# Altium project PCB_Project.PrjPcb
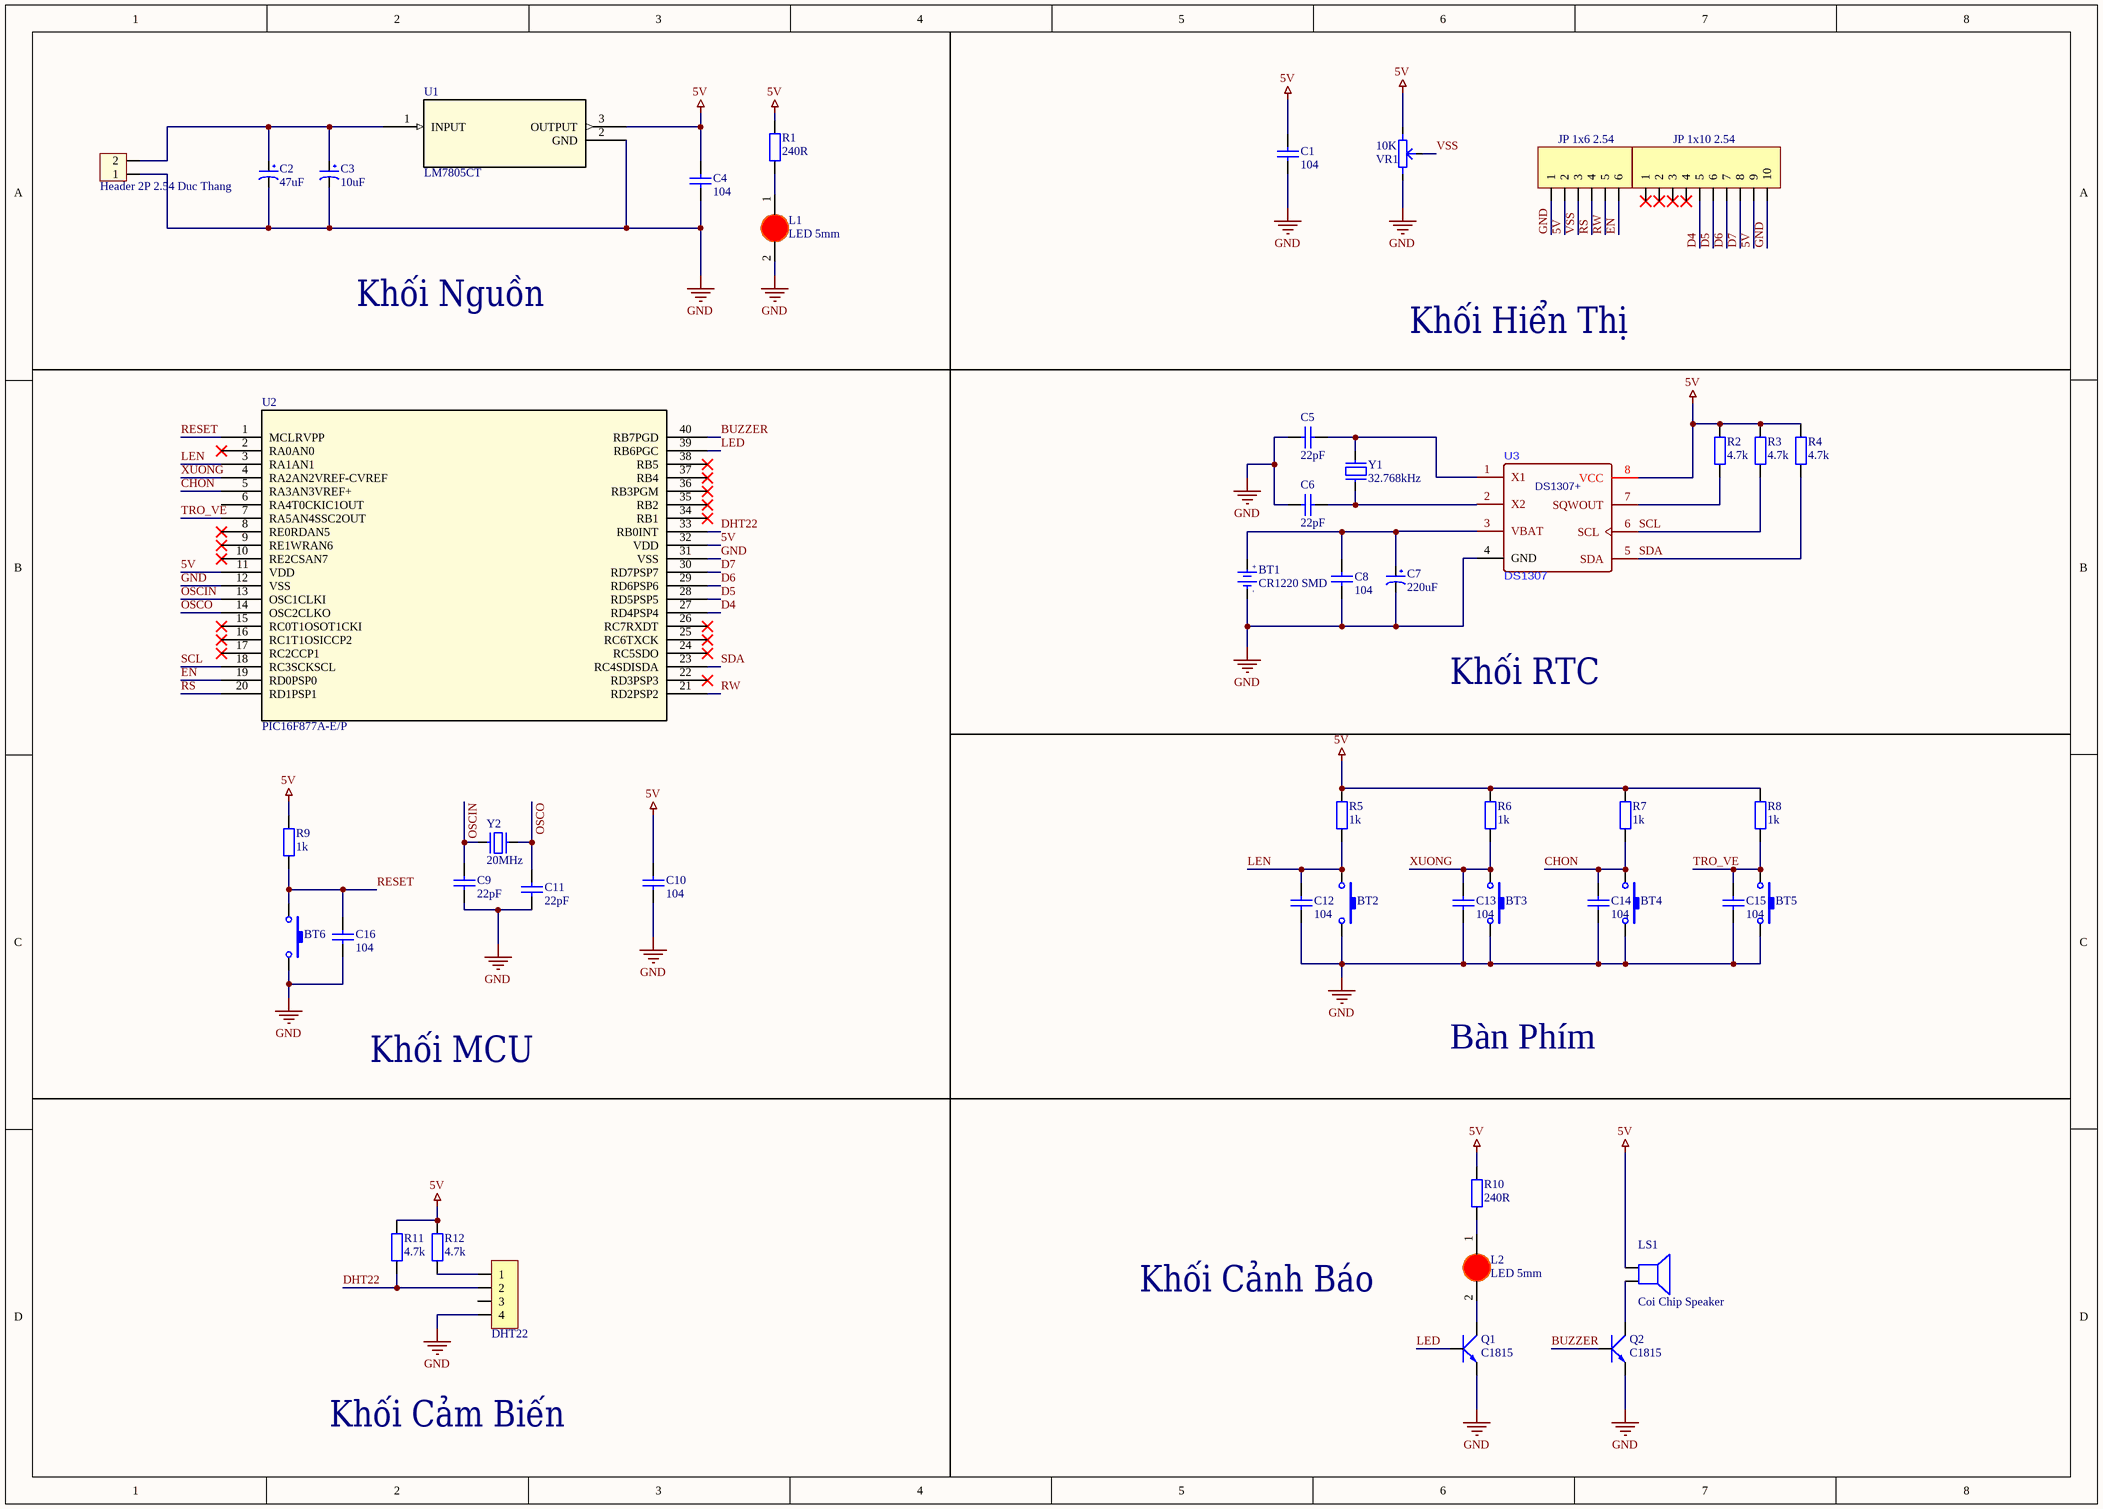
[diagram p0: Sheet1.SchDoc]
1 sheet, 49 parts. Net scope: global (net labels, ports and power ports of the same name join across sheets).
Board file: PCB1.PcbDoc

## Sheet Sheet1.SchDoc
size A3; SheetNumber: 1; SheetTotal: 1

### Parts
BT1  CR1220 SMD  [DE PIN CR1220]
BT2  Nut Nhan 2 Chan SMD 3x6x2.5  [Nut Nhan 2 Chan SMD 3x6x2.5]  (value not drawn)
BT3  Nut Nhan 2 Chan SMD 3x6x2.5  [Nut Nhan 2 Chan SMD 3x6x2.5]  (value not drawn)
BT4  Nut Nhan 2 Chan SMD 3x6x2.5  [Nut Nhan 2 Chan SMD 3x6x2.5]  (value not drawn)
BT5  Nut Nhan 2 Chan SMD 3x6x2.5  [Nut Nhan 2 Chan SMD 3x6x2.5]  (value not drawn)
BT6  Nut Nhan 2 Chan SMD 3x6x2.5  [Nut Nhan 2 Chan SMD 3x6x2.5]  (value not drawn)
C1  104  [tu gom]
C2  47uF  [tu hoa 5mm]
C3  10uF  [tu hoa 4mm]
C4  104  [tu gom]
C5  22pF  [tu gom]
C6  22pF  [tu gom]
C7  220uF  [tu hoa 5mm]
C8  104  [tu gom]
C9  22pF  [tu gom]
C10  104  [tu gom]
C11  22pF  [tu gom]
C12  104  [tu gom]
C13  104  [tu gom]
C14  104  [tu gom]
C15  104  [tu gom]
C16  104  [tu gom]
H1  Header 2P 2.54 Duc Thang  [XH2.54M-2]
JP1  JP 1x6 2.54  [JP 1x6 CT]
JP2  JP 1x10 2.54  [JP 1x10 CT]
JP3  DHT22  [JP 1x4 CT]
L1  LED 5mm  [LED-5MM-RED]
L2  LED 5mm  [LED-5MM-RED]
LS1  Coi Chip Speaker  [Coi Chip Speacker]
Q1  C1815  [TO92]
Q2  C1815  [TO92]
R1  240R  [tro vach 1/2w]
R2  4.7k  [tro vach 1/2w]
R3  4.7k  [tro vach 1/2w]
R4  4.7k  [tro vach 1/2w]
R5  1k  [tro vach 1/2w]
R6  1k  [tro vach 1/2w]
R7  1k  [tro vach 1/2w]
R8  1k  [tro vach 1/2w]
R9  1k  [tro vach 1/2w]
R10  240R  [tro vach 1/2w]
R11  4.7k  [tro vach 1/2w]
R12  4.7k  [tro vach 1/2w]
U1  LM7805CT  [TO220-3_ONS]
U2  PIC16F877A-E/P  [PDIP40_600MC_MCH]
U3  DS1307  [SOP 8]
VR1  10K  [Bien Tro Tam Giac Dung]
Y1  32.768kHz  [Thach Anh 2 Chan 32,768 KHz]
Y2  20MHz  [Thach Anh 2 chan cam]

### Nets
5V: C1.1 C4.1 C10.1 JP1.2 JP2.9 LS1.1 R1.2 R2.2 R3.2 R4.2 R5.2 R6.2 R7.2 R8.2 R9.2 R10.2 R11.2 R12.2 U1.3(OUTPUT) U2.11(VDD) U2.32(VDD) U3.8(VCC) VR1.1
GND: BT1.2(GND) BT2.2 BT3.2 BT4.2 BT5.2 BT6.2 C1.2 C2.2 C3.2 C4.2 C5.2 C6.2 C7.2 C8.2 C9.2 C10.2 C11.2 C12.2 C13.2 C14.2 C15.2 C16.2 H1.1 JP1.1 JP2.10 JP3.4 L1.2(K) Q1.1(E) Q2.1(E) U1.2(GND) U2.12(VSS) U2.31(VSS) U3.4(GND) VR1.3
BUZZER: Q2.3(B) U2.40(RB7PGD)
CHON: BT4.1 C14.1 R7.1 U2.5(RA3AN3VREF+)
D4: JP2.5 U2.27(RD4PSP4)
D5: JP2.6 U2.28(RD5PSP5)
D6: JP2.7 U2.29(RD6PSP6)
D7: JP2.8 U2.30(RD7PSP7)
DHT22: JP3.2 R11.1 U2.33(RB0INT)
EN: JP1.6 U2.19(RD0PSP0)
LED: Q1.3(B) U2.39(RB6PGC)
LEN: BT2.1 C12.1 R5.1 U2.3(RA1AN1)
OSCIN: C9.1 U2.13(OSC1CLKI) Y2.1
OSCO: C11.1 U2.14(OSC2CLKO) Y2.2
RESET: BT6.1 C16.1 R9.1 U2.1(MCLRVPP)
RS: JP1.4 U2.20(RD1PSP1)
RW: JP1.5 U2.21(RD2PSP2)
SCL: R3.1 U2.18(RC3SCKSCL) U3.6(SCL)
SDA: R4.1 U2.23(RC4SDISDA) U3.5(SDA)
TRO_VE: BT5.1 C15.1 R8.1 U2.7(RA5AN4SSC2OUT)
VSS: JP1.3 VR1.2
XUONG: BT3.1 C13.1 R6.1 U2.4(RA2AN2VREF-CVREF)
NetBT1_1: BT1.1(+3V) C7.1 C8.1 U3.3(VBAT)
NetC2_1: C2.1 C3.1 H1.2 U1.1(INPUT)
NetC5_1: C5.1 U3.1(X1) Y1.2
NetC6_1: C6.1 U3.2(X2) Y1.1
NetJP3_1: JP3.1 R12.1
NetL1_1: L1.1(A) R1.1
NetL2_1: L2.1(A) R10.1
NetL2_2: L2.2(K) Q1.2(C)
NetLS1_2: LS1.2 Q2.2(C)
NetR2_1: R2.1 U3.7(SQWOUT)

Not connected (* = marked no-connect by the designer): JP2 1* 2* 3* 4*; JP3 3; U2 2(RA0AN0)* 6(RA4T0CKIC1OUT) 8(RE0RDAN5)* 9(RE1WRAN6)* 10(RE2CSAN7)* 15(RC0T1OSOT1CKI)* 16(RC1T1OSICCP2)* 17(RC2CCP1)* 22(RD3PSP3)* 24(RC5SDO)* 25(RC6TXCK)* 26(RC7RXDT)* 34(RB1)* 35(RB2)* 36(RB3PGM)* 37(RB4)* 38(RB5)*

### Notes on the sheet
- Khối Nguồn
- Khối Hiển Thị
- Khối RTC
- Bàn Phím
- Khối MCU
- Khối Cảnh Báo
- Khối Cảm Biến
- (in symbol De pin CR1220 SMD) +; -
- (in symbol DS1307) DS1307+

### Library data of the parts
BT1 = De pin CR1220 SMD: Ten: Đế PIN CR1220 SMD; Ma_Hang: MH000833
BT2-BT6 = Nut Nhan 2 Chan SMD 3x6x2.5: Ma_Hang: MH001036; Ten: Nút Nhấn 2 Chân 3x6x2.5MM SMD
C1 C4 C8 C10 C12-C16 = Tu gom 104 50V: Cắm; So_Chan: 2; Ten_Linh_Kien: Tụ gốm 104 100nF 50V; Don_Vi: Con; Ma_Hang: MH004761; Chung_Loai: Cắm; Kieu_Chan: *
C2 = Tu Hoa 47uF 25V 5x8: Cắm; Don_Vi: Con; So_Chan: 2; Ten_Linh_Kien: Tụ Hóa 47uF 25V; Ma_Hang: MH006860; Chung_Loai: Cắm; Kieu_Chan: *
C3 = Tu Hoa 10uF 25V 4x7: Cắm; So_Chan: 2; Ten_Linh_Kien: Tụ Hóa 10uF 25V 4x7MM; Don_Vi: Con; Ma_Hang: MH001349; Chung_Loai: Cắm; Kieu_Chan: *
C5 C6 C9 C11 = Tu gom 22pF 50V: Cắm; Don_Vi: Con; So_Chan: 2; Ten_Linh_Kien: Tụ gốm 22P 50V; Ma_Hang: MH004771; Chung_Loai: Cắm; Kieu_Chan: *
C7 = Tu Hoa 220uF 10V 6x11: Cắm; Don_Vi: Con; So_Chan: 2; Ten_Linh_Kien: Tụ Hóa 220uF 10V 6x11MM; Ma_Hang: MH004510; Chung_Loai: Cắm; Kieu_Chan: *
H1 = Header 2P 2.54 Duc Thang: Cắm; Ten_Linh_Kien: Header 2P XH2.54-2P Đực Thẳng; Don_Vi: Con; Ma_Hang: MH001283; Chung_Loai: Cắm
JP1 = JP 1x6 2.54 Cai Thang: Cắm; Ten_Linh_Kien: Jump Đơn Cái 2.54MM 1x20P Thẳng; Don_Vi: Con; Ma_Hang: MH004006; Ghi_Chu: *; Kieu_Chan: *; Chung_Loai: Cắm
JP2 = JP 1x10 2.54 Cai Thang: Cắm; Ten_Linh_Kien: Jump Đơn Cái 2.54MM 1x20P Thẳng; Don_Vi: Con; Ma_Hang: MH004006; Ghi_Chu: *; Kieu_Chan: *; Chung_Loai: Cắm
JP3 = JP 1x4 2.54 Cai Thang: Cắm; Ten_Linh_Kien: Jump Đơn Cái 2.54MM 1x20P Thẳng; Don_Vi: Con; Ma_Hang: MH004006; Ghi_Chu: *; Kieu_Chan: *; Chung_Loai: Cắm
L1 L2 = LED 5mm Do: Cắm; Don_Vi: Con; Ma_Hang: MH008967; Ten_Linh_Kien: Led 5MM Phủ Đỏ (1000c); Ghi_Chu: *; Kieu_Chan: *; Chung_Loai: Cắm
LS1 = Coi Chip Speaker: Còi chip
Q1 Q2 = Trans C1815 DIP: NPN transistor; Value: C9014
R1 R5-R10 = Tro Vach 1/2W 5% 240R: Cắm; Don_Vi: Con; So_Chan: 2; Ten_Linh_Kien: Trở 5% 1/2w 240R; Ma_Hang: MH006191; Kieu_Chan: *; Chung_Loai: Cắm
R2-R4 R11 R12 = Tro Vach 1/2W 5% 4.7k: Cắm; Don_Vi: Con; So_Chan: 2; Ten_Linh_Kien: Trở 5% 1/2w 4.7k; Ma_Hang: MH006198; Chung_Loai: Cắm; Kieu_Chan: *
U1 = LM7805CT: No Description Available; Mfr_Name: onsemi; Copyright: Copyright (C) 2023 Ultra Librarian. All rights reserved.; Manufacturer_Part_Number: LM7805CT; RefDes: RefDes; Type: DEV
U2 = PIC16F877A-EP: No Description Available; Mfr_Name: Microchip; Copyright: Copyright (C) 2023 Ultra Librarian. All rights reserved.; Manufacturer_Part_Number: PIC16F877A-E/P; RefDes: RefDes; Type: DEV
U3 = DS1307: C5145427
VR1 = Bien tro tam giac 10K Dung: Cắm; Ma_Hang: MH000919; Don_Vi: Con; Ten_Linh_Kien: Biến Trở Tam Giác 103-10K RM065 (Chân Đứng); Chung_Loai: Cắm; Kieu_Chan: *
Y1 = Thach Anh 2 chan 32,768 Khz: Crystal For all Crystal 2pin.; Value: 4Mhz
Y2 = Thach Anh 2 chan Cam: Crystal For all Crystal 2pin.; Value: 4Mhz